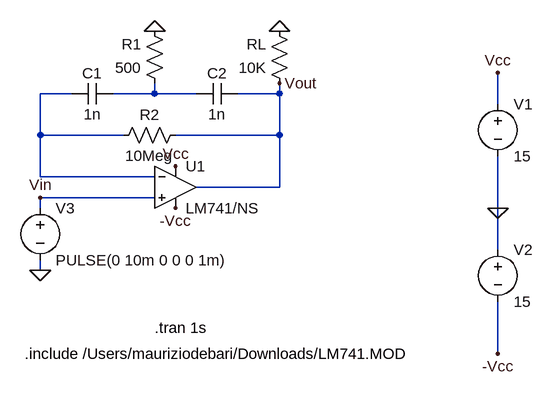
[diagram p0: schematic opamp_LM741.asc]
opamp_LM741.asc, the LTspice schematic file:
Version 4
SHEET 1 956 680
WIRE 240 160 192 160
WIRE 368 160 368 144
WIRE 368 160 304 160
WIRE 432 160 368 160
WIRE 560 160 560 144
WIRE 560 160 496 160
WIRE 896 176 896 128
WIRE 192 224 192 160
WIRE 320 224 192 224
WIRE 560 224 560 160
WIRE 560 224 400 224
WIRE 192 288 192 224
WIRE 368 288 192 288
WIRE 560 304 560 224
WIRE 560 304 432 304
WIRE 368 320 192 320
WIRE 192 336 192 320
WIRE 896 336 896 256
WIRE 896 400 896 336
WIRE 192 432 192 416
WIRE 896 560 896 480
FLAG 896 336 0
FLAG 896 128 Vcc
FLAG 896 560 -Vcc
FLAG 400 272 Vcc
FLAG 400 336 -Vcc
FLAG 368 64 0
FLAG 560 64 0
FLAG 192 432 0
FLAG 192 320 Vin
FLAG 560 144 Vout
SYMBOL /Opamps/opamp2 400 240 R0
SYMATTR InstName U1
SYMATTR Value LM741/NS
SYMBOL /voltage 896 160 R0
SYMATTR InstName V1
SYMATTR Value 15
SYMBOL /voltage 896 384 R0
SYMATTR InstName V2
SYMATTR Value 15
SYMBOL /voltage 192 320 R0
SYMATTR InstName V3
SYMATTR Value PULSE(0 10m 0 0 0 1m)
SYMBOL /res 416 208 R90
WINDOW 0 0 56 VBottom 2
WINDOW 3 32 56 VTop 2
SYMATTR InstName R2
SYMATTR Value 10Meg
SYMBOL /res 384 160 R180
WINDOW 0 36 76 Left 2
WINDOW 3 36 40 Left 2
SYMATTR InstName R1
SYMATTR Value 500
SYMBOL /res 576 160 R180
WINDOW 0 36 76 Left 2
WINDOW 3 36 40 Left 2
SYMATTR InstName RL
SYMATTR Value 10K
SYMBOL /cap 496 144 R90
WINDOW 0 0 32 VBottom 2
WINDOW 3 32 32 VTop 2
SYMATTR InstName C2
SYMATTR Value 1n
SYMBOL /cap 304 144 R90
WINDOW 0 0 32 VBottom 2
WINDOW 3 32 32 VTop 2
SYMATTR InstName C1
SYMATTR Value 1n
TEXT 168 560 Left 2 !.include /Users/mauriziodebari/Downloads/LM741.MOD
TEXT 368 520 Left 2 !.tran 1s

The netlist it stands for:
* opamp_LM741.asc
XU1 Vin N001 Vcc -Vcc Vout LM741/NS  ; pins In+ In- V+ V- OUT
V1 Vcc 0 15
V2 0 -Vcc 15
V3 Vin 0 PULSE(0 10m 0 0 0 1m)
R2 Vout N001 10Meg
R1 N002 0 500
RL Vout 0 10K
C2 Vout N002 1n
C1 N002 N001 1n
.include /Users/mauriziodebari/Downloads/LM741.MOD
.tran 1s
.backanno
.end